# Altium schematic sheet Cover.SchDoc
size B
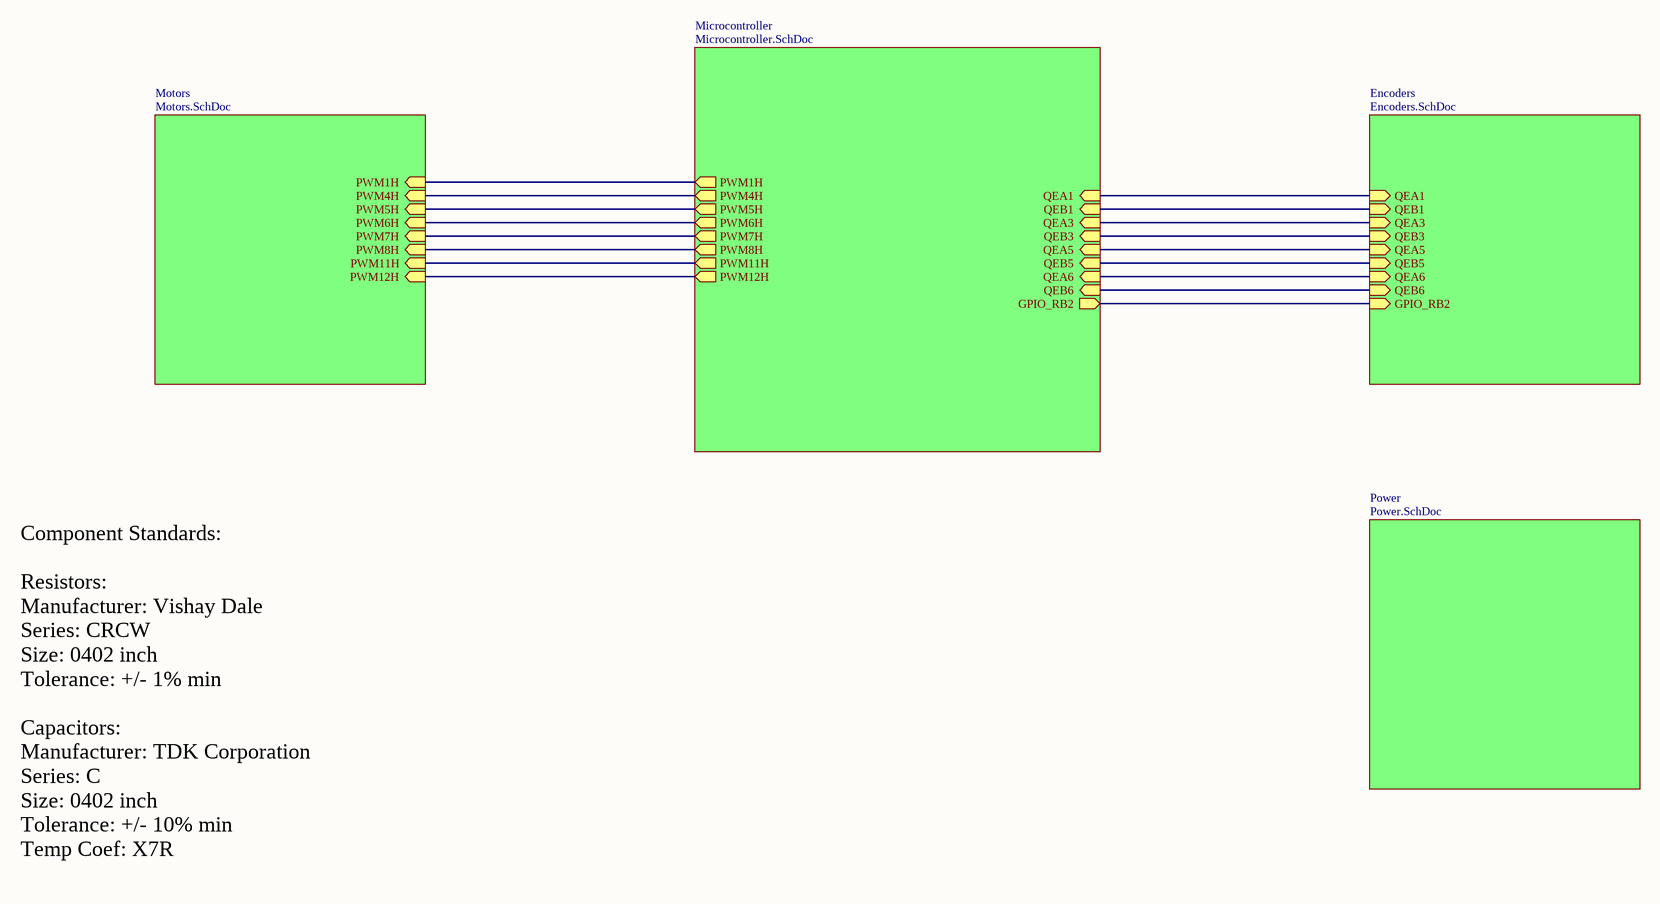
[diagram p0: Cover.SchDoc]

## Sub-sheets
Encoders = Encoders.SchDoc: GPIO_RB2 (in), QEA5 (in), QEA1 (in), QEB5 (in), QEA6 (in), QEB6 (in), QEB1 (in), QEA3 (in), QEB3 (in)
Microcontroller = Microcontroller.SchDoc: QEA6 (in), QEA5 (in), QEB5 (in), QEB1 (in), QEA1 (in), GPIO_RB2 (out), QEB6 (in), QEA3 (in), QEB3 (in), PWM1H (out), PWM11H (out), PWM7H (out), PWM4H (out), PWM5H (out), PWM8H (out), PWM6H (out), PWM12H (out)
Motors = Motors.SchDoc: PWM7H (in), PWM12H (in), PWM5H (in), PWM1H (in), PWM4H (in), PWM6H (in), PWM11H (in), PWM8H (in)
Power = Power.SchDoc: no entries

## Nets
(unnamed): sheet Microcontroller/QEA6, sheet Encoders/QEA6
(unnamed): sheet Microcontroller/QEA5, sheet Encoders/QEA5
(unnamed): sheet Microcontroller/QEB5, sheet Encoders/QEB5
(unnamed): sheet Microcontroller/QEB1, sheet Encoders/QEB1
(unnamed): sheet Microcontroller/QEA1, sheet Encoders/QEA1
(unnamed): sheet Microcontroller/GPIO_RB2, sheet Encoders/GPIO_RB2
(unnamed): sheet Microcontroller/QEB6, sheet Encoders/QEB6
(unnamed): sheet Microcontroller/QEA3, sheet Encoders/QEA3
(unnamed): sheet Microcontroller/QEB3, sheet Encoders/QEB3
(unnamed): sheet Microcontroller/PWM1H, sheet Motors/PWM1H
(unnamed): sheet Microcontroller/PWM11H, sheet Motors/PWM11H
(unnamed): sheet Microcontroller/PWM7H, sheet Motors/PWM7H
(unnamed): sheet Microcontroller/PWM4H, sheet Motors/PWM4H
(unnamed): sheet Microcontroller/PWM5H, sheet Motors/PWM5H
(unnamed): sheet Microcontroller/PWM8H, sheet Motors/PWM8H
(unnamed): sheet Microcontroller/PWM6H, sheet Motors/PWM6H
(unnamed): sheet Microcontroller/PWM12H, sheet Motors/PWM12H

## Notes on the sheet
- Component Standards:
  Resistors:
  Manufacturer: Vishay Dale
  Series: CRCW
  Size: 0402 inch
  Tolerance: +/- 1% min
  Capacitors:
  Manufacturer: TDK Corporation
  Series: C
  Size: 0402 inch
  Tolerance: +/- 10% min
  Temp Coef: X7R